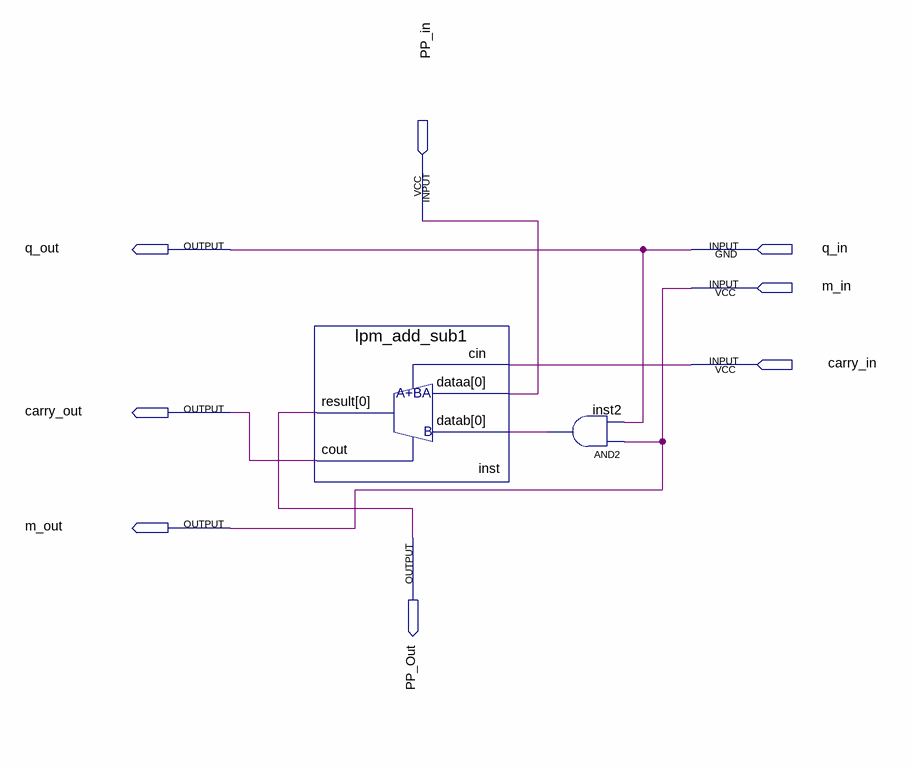
[diagram p0: schematic sheet]
// Quartus schematic ArrayMultBlock.bdf as structural Verilog: 2 symbols, 8 pins
module ArrayMultBlock (
  input  PP_in,
  input  q_in,
  input  m_in,
  input  carry_in,
  output q_out,
  output carry_out,
  output m_out,
  output PP_Out
);

  wire inst2_out;

  lpm_add_sub1 inst (.cin(carry_in), .dataa(PP_in), .datab(inst2_out), .result(PP_Out), .cout(carry_out));
  and inst2 (inst2_out, m_in, q_in);

  assign m_out = m_in;
  assign q_out = q_in;
endmodule
